# EAGLE design Serial-7-Segment-Shield (EAGLE 6.5.0)
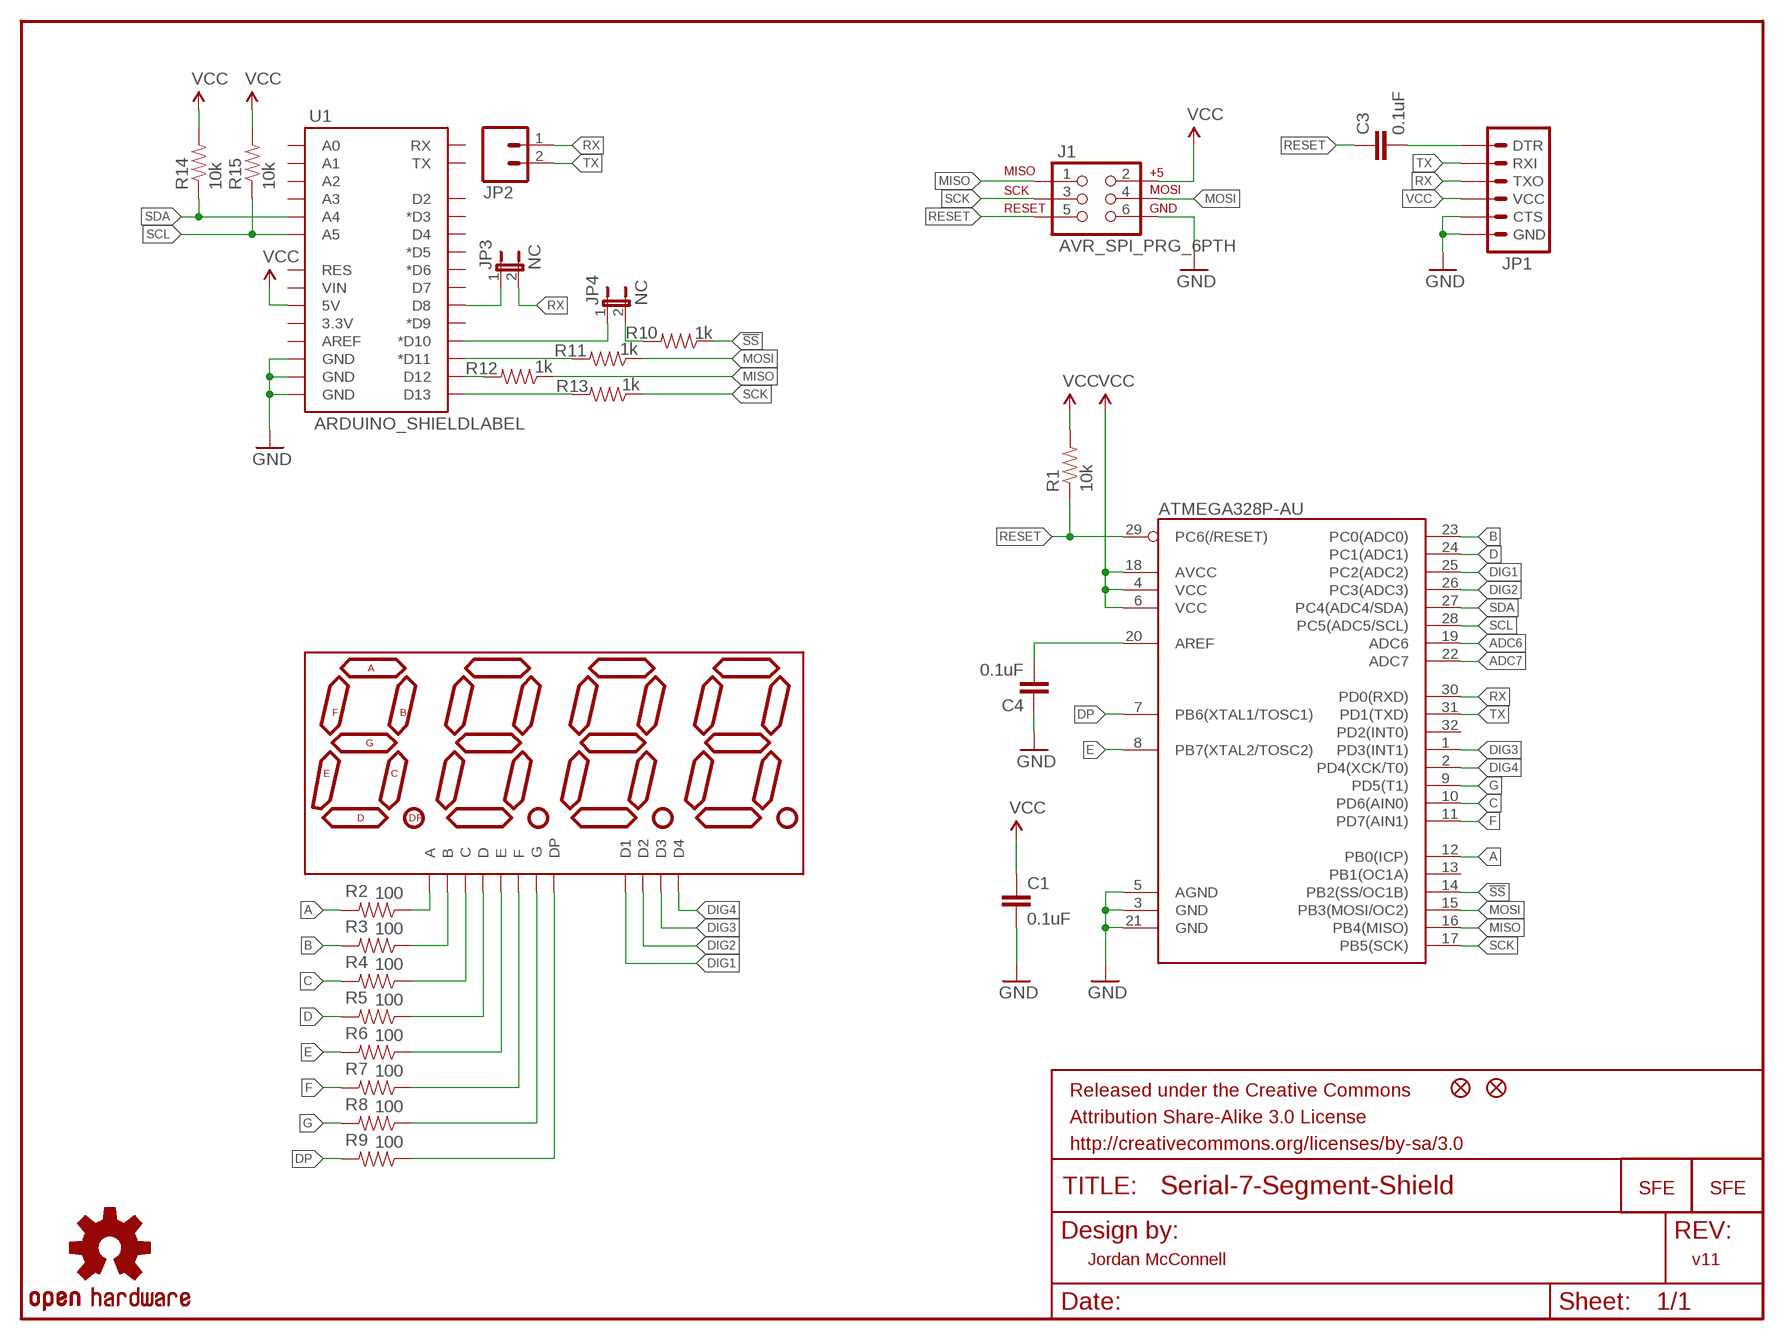
[diagram p0: schematic, sheet 1]

## Parts
ATMEGA328P-AU  ATMEGA328P-AU  ATMEGA168  [TQFP32-08]
C1  0.1uF  CAP0603-CAP  [0603-CAP]
C3  0.1uF  CAP0603-CAP  [0603-CAP]
C4  0.1uF  CAP0603-CAP  [0603-CAP]
FRAME1  FRAME-LETTER  [CREATIVE_COMMONS]
J1  AVR_SPI_PRG_6PTH  [2X3]
JP1  ARDUINO_SERIAL_PROGRAMPTH  [1X06]
JP2  M02PTH  [1X02]
JP3  NC  JUMPER-2SMD-NC  [SJ_2S]
JP4  NC  JUMPER-2SMD-NC  [SJ_2S]
JP9  FIDUCIALUFIDUCIAL  [MICRO-FIDUCIAL]
JP10  FIDUCIALUFIDUCIAL  [MICRO-FIDUCIAL]
LOGO1  LOGO-SFENEW  [SFE-NEW-WEBLOGO]
LOGO2  LOGO-SFENEW  [SFE-NEW-WEBLOGO]
R1  10k  RESISTOR0603-RES  [0603-RES]
R2  100  RESISTOR0603-RES  [0603-RES]
R3  100  RESISTOR0603-RES  [0603-RES]
R4  100  RESISTOR0603-RES  [0603-RES]
R5  100  RESISTOR0603-RES  [0603-RES]
R6  100  RESISTOR0603-RES  [0603-RES]
R7  100  RESISTOR0603-RES  [0603-RES]
R8  100  RESISTOR0603-RES  [0603-RES]
R9  100  RESISTOR0603-RES  [0603-RES]
R10  1k  RESISTOR0603-RES  [0603-RES]
R11  1k  RESISTOR0603-RES  [0603-RES]
R12  1k  RESISTOR0603-RES  [0603-RES]
R13  1k  RESISTOR0603-RES  [0603-RES]
R14  10k  RESISTOR0603-RES  [0603-RES]
R15  10k  RESISTOR0603-RES  [0603-RES]
U1  ARDUINO_SHIELDLABEL  [DUEMILANOVE_SHIELD]
U$1  7-SEGMENT-4DIGIT-COUNTERPTH  [7-SEGMENT-4DIGIT-COUNTER]
U$4  OSHW-LOGOS  [OSHW-LOGO-S]

## Nets
!SS: ATMEGA328P-AU.14(PB2(SS/OC1B)) R10.1
A: ATMEGA328P-AU.12(PB0(ICP)) R2.2
ADC6: ATMEGA328P-AU.19(ADC6)
ADC7: ATMEGA328P-AU.22(ADC7)
B: ATMEGA328P-AU.23(PC0(ADC0)) R3.2
C: ATMEGA328P-AU.10(PD6(AIN0)) R4.2
D: ATMEGA328P-AU.24(PC1(ADC1)) R5.2
DIG1: ATMEGA328P-AU.25(PC2(ADC2)) U$1.12(D1)
DIG2: ATMEGA328P-AU.26(PC3(ADC3)) U$1.9(D2)
DIG3: ATMEGA328P-AU.1(PD3(INT1)) U$1.8(D3)
DIG4: ATMEGA328P-AU.2(PD4(XCK/T0)) U$1.6(D4)
DP: ATMEGA328P-AU.7(PB6(XTAL1/TOSC1)) R9.2
E: ATMEGA328P-AU.8(PB7(XTAL2/TOSC2)) R6.2
F: ATMEGA328P-AU.11(PD7(AIN1)) R7.2
G: ATMEGA328P-AU.9(PD5(T1)) R8.2
GND: ATMEGA328P-AU.3(GND) ATMEGA328P-AU.5(AGND) ATMEGA328P-AU.21(GND) C1.2 C4.1 J1.6 JP1.5(CTS) JP1.6(GND) U1.GND@0(GND) U1.GND@1(GND) U1.GND@2(GND)
MISO: ATMEGA328P-AU.16(PB4(MISO)) J1.1 R12.1
MOSI: ATMEGA328P-AU.15(PB3(MOSI/OC2)) J1.4 R11.1
N$1: ATMEGA328P-AU.20(AREF) C4.2
N$2: R13.2 U1.D13
N$3: R12.2 U1.D12
N$4: R11.2 U1.D11(*D11)
N$5: JP4.2 R10.2
N$6: JP4.1 U1.D10(*D10)
N$7: JP3.1 U1.D8
N$11: R2.1 U$1.11(A)
N$12: R3.1 U$1.7(B)
N$13: C3.2 JP1.1(DTR)
N$14: R4.1 U$1.4(C)
N$15: R5.1 U$1.2(D)
N$16: R6.1 U$1.1(E)
N$17: R7.1 U$1.10(F)
N$18: R8.1 U$1.5(G)
N$19: R9.1 U$1.3(DP)
RESET: ATMEGA328P-AU.29(PC6(/RESET)) C3.1 J1.5 R1.1
RX: ATMEGA328P-AU.30(PD0(RXD)) JP1.3(TXO) JP2.1 JP3.2
SCK: ATMEGA328P-AU.17(PB5(SCK)) J1.3 R13.1
SCL: ATMEGA328P-AU.28(PC5(ADC5/SCL)) R15.1 U1.A5
SDA: ATMEGA328P-AU.27(PC4(ADC4/SDA)) R14.1 U1.A4
TX: ATMEGA328P-AU.31(PD1(TXD)) JP1.2(RXI) JP2.2
VCC: ATMEGA328P-AU.4(VCC) ATMEGA328P-AU.6(VCC) ATMEGA328P-AU.18(AVCC) C1.1 J1.2 JP1.4(VCC) R1.2 R14.2 R15.2 U1.5V
Unconnected: ATMEGA328P-AU.13(PB1(OC1A)) ATMEGA328P-AU.32(PD2(INT0)) U1.3.3V U1.A0 U1.A1 U1.A2 U1.A3 U1.AREF U1.D2 U1.D3(*D3) U1.D4 U1.D5(*D5) U1.D6(*D6) U1.D7 U1.D9(*D9) U1.RES U1.RX U1.TX U1.VIN

## Notes on the sheet
- Jordan McConnell | v11

## Library data of the parts
ATMEGA328P-AU = SparkFun:ATMEGA168
C1 = SparkFun:CAP: Capacitor Standard 0603 ceramic capacitor, and 0.1" leaded capacitor.
C3 C4 = SparkFun-Passives:CAP: Capacitor Standard 0603 ceramic capacitor, and 0.1" leaded capacitor.
FRAME1 = SparkFun-Aesthetics:FRAME-LETTER: Schematic Frame Standard 8.5x11 US Letter frame
J1 = SparkFun-Connectors:AVR_SPI_PRG_6: AVR ISP 6 Pin This is the reduced ISP connector for AVR programming. Common on Arduino. This footprint will take up less PCB space and can be used with a 10-pin to 6-pin adapter such as SKU: BOB-08508
JP1 = SparkFun-Connectors:ARDUINO_SERIAL_PROGRAM: FTDI connector footprints
JP2 = SparkFun-Connectors:M02: Header 2 Standard 2-pin 0.1" header. Use with straight break away headers (SKU : PRT-00116), right angle break away headers (PRT-00553), swiss pins (PRT-00743), machine pins (PRT-00117), and female headers (PRT-00115). Molex polarized connector foot print use with SKU : PRT-08233 with associated crimp pins and housings.
JP3 JP4 = SparkFun-Passives:JUMPER-2: Jumper Basic 0.1" spaced jumper. Use with breakaway headers.
JP9 JP10 = SparkFun:FIDUCIAL: Fiducial Alignment Points Various fiducial points for machine vision alignment.
LOGO1 LOGO2 = SparkFun-Aesthetics:LOGO-SFE: Spark Fun Electronics PCB Logo This is the standard Spark Fun Electronics PCB logo.
R1-R15 = SparkFun:RESISTOR: Resistor Basic schematic elements and footprints for 0603, 1206, and PTH 1/10th watt (small) resistors.
U1 = SparkFun-Boards:ARDUINO_SHIELD: Arduino shield footprint
U$1 = SparkFun-Displays:7-SEGMENT-4DIGIT-COUNTER
U$4 = SparkFun-Aesthetics:OSHW-LOGO: Open Source Hardware Logo This logo indicates the piece of hardware it is found on incorporates a OSHW license and/or adheres to the definition of open source hardware found here: http://freedomdefined.org/OSHW

## Board
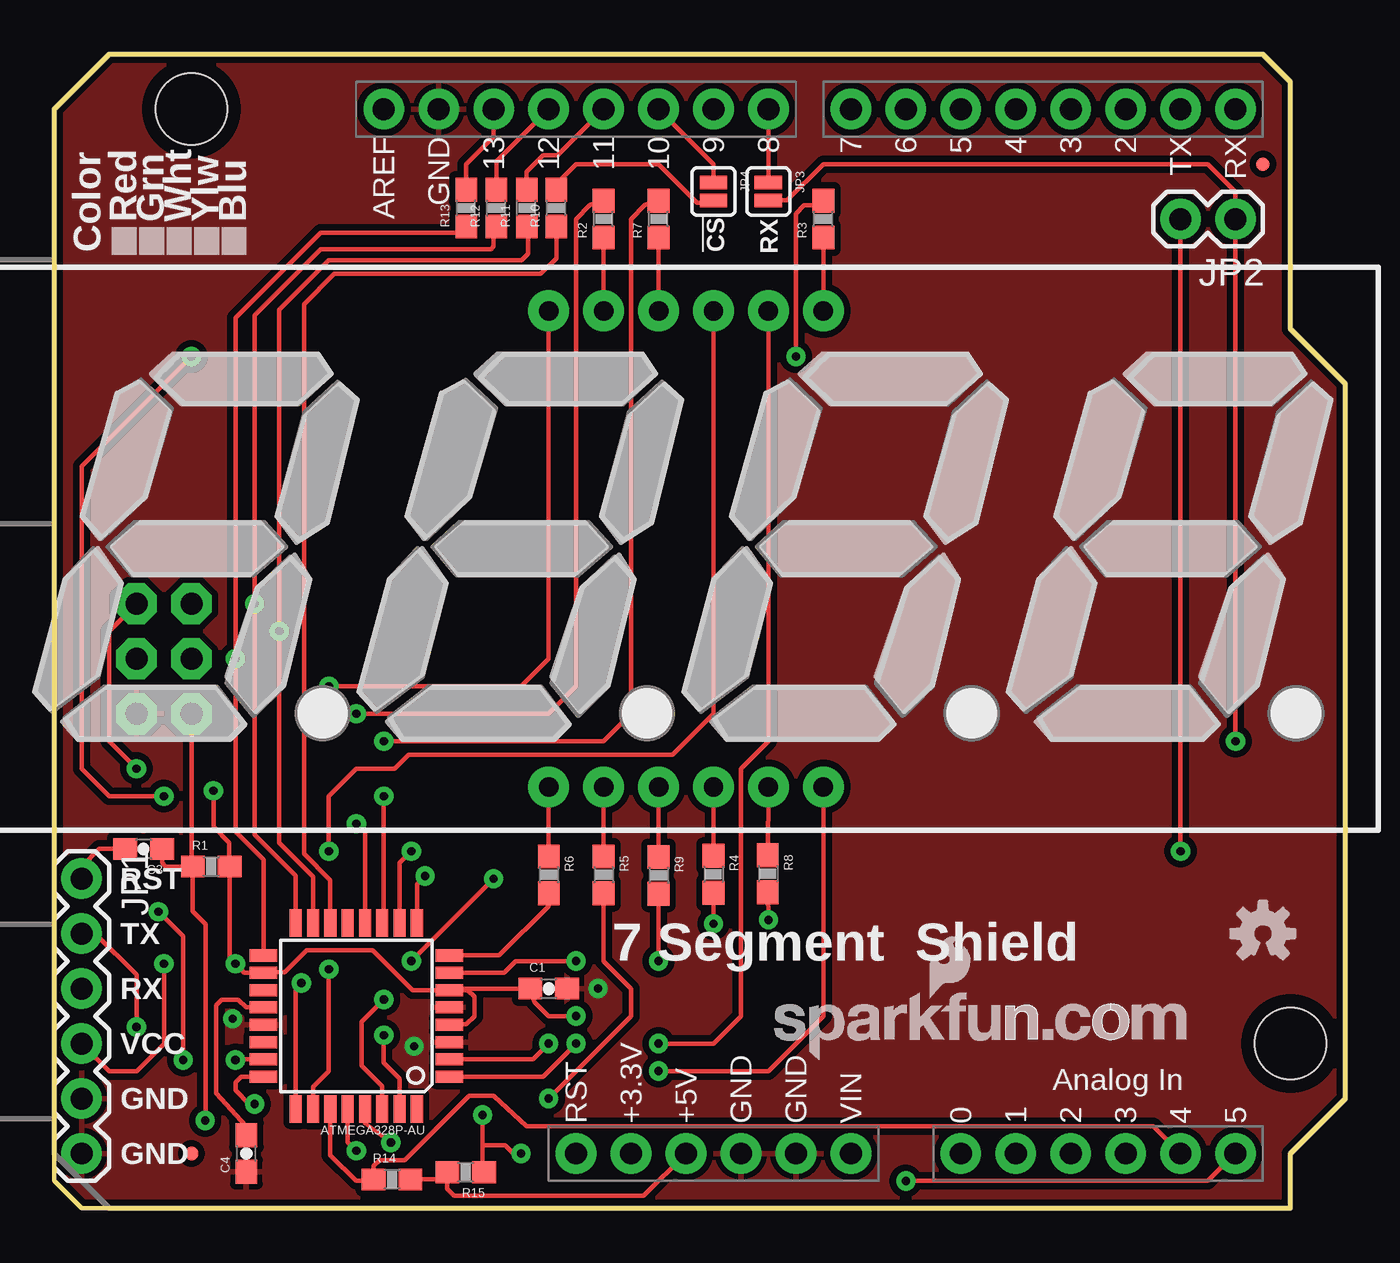
[diagram p1: board, top side]
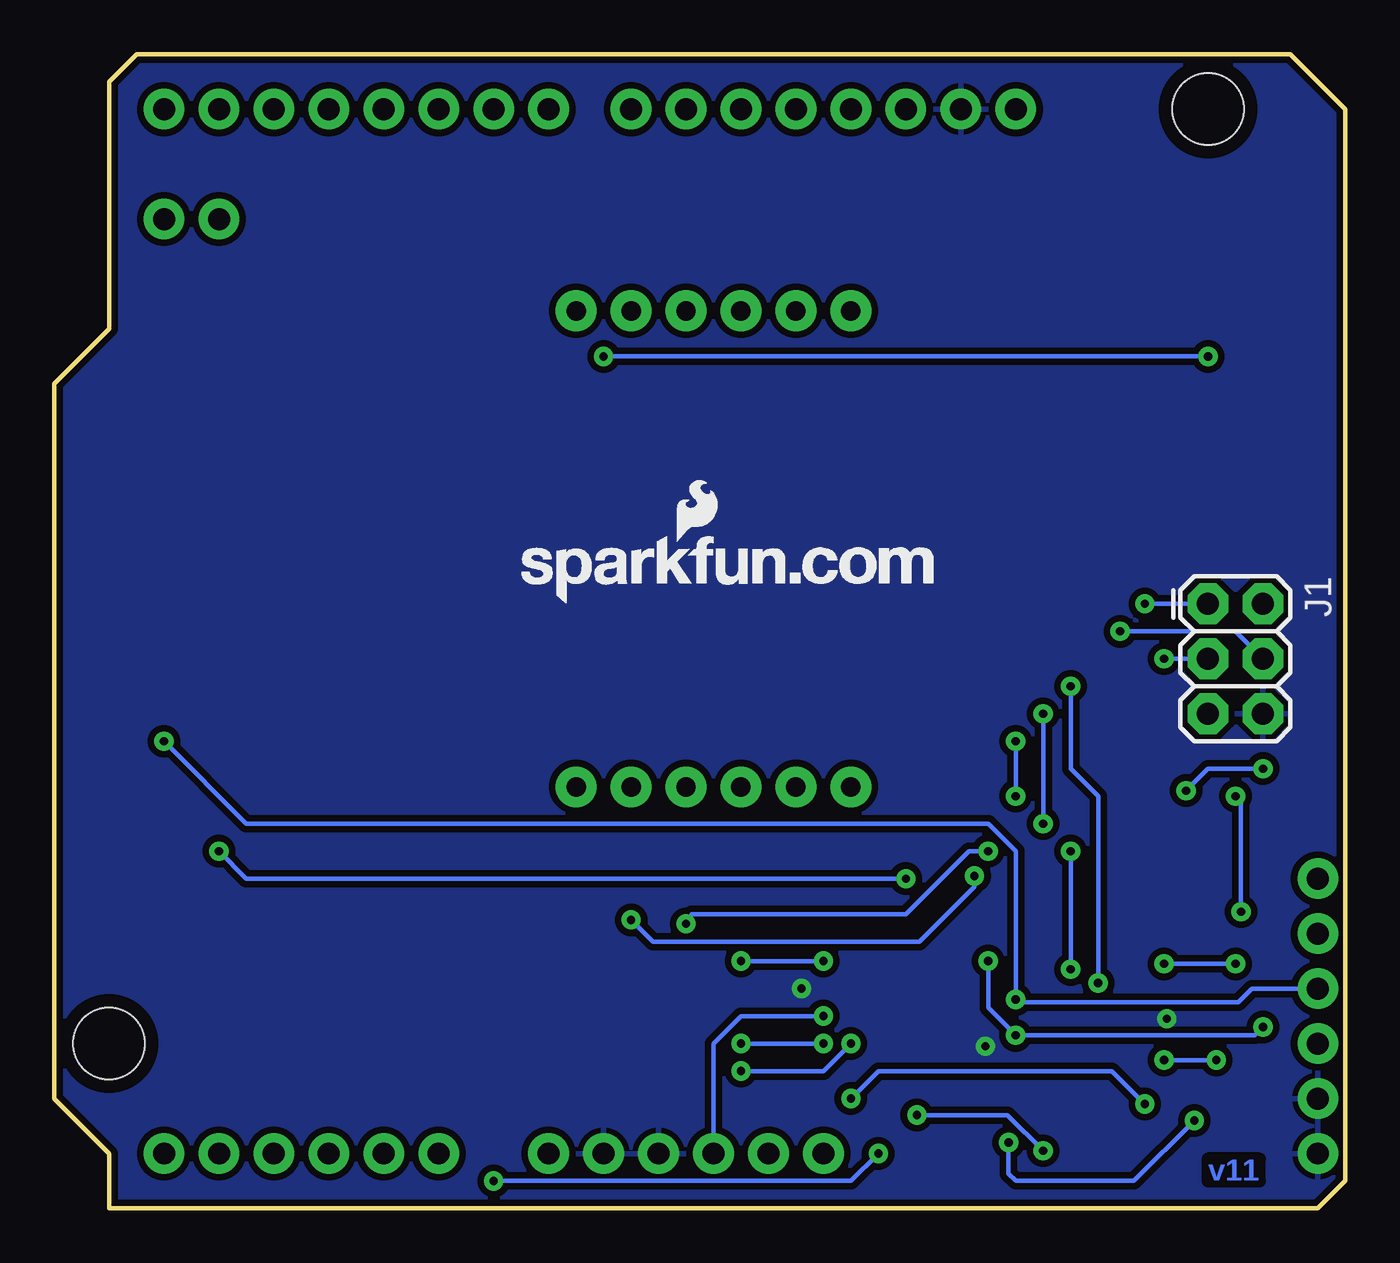
[diagram p2: board, bottom side, seen from below]

Size 59.69 x 53.34 mm. Coordinates in mm from the lower left corner, seen from the top.
Outline: 0,1.27 0,50.8 2.54,53.34 55.88,53.34 57.15,52.07 57.15,40.64 59.69,38.1 59.69,5.08 57.15,2.54 57.15,0 1.27,0 0,1.27
Copper layers (1*16): Top 0.035mm / dielectric 1.5mm / Bottom 0.035mm
Design rules "SparkFun": minimum track width 7mil, minimum drill 15mil, track to track 8mil, track to pad 8mil, pad to pad 8mil, via to via 8mil, smd to smd 8mil, copper to edge 8mil, drill to drill 8mil, minimum pad ring 12mil, minimum via ring 10mil, stop-mask expansion 4mil, vias tented up to drill 20mil, thermal gap 10mil

### Footprints (pad centres in the part's own frame; a part is rotated, then mirrored left to right if it is on the bottom)
TQFP32-08 = smd 1.27 x 0.559: 1 -4.293,2.8; 2 -4.293,2; 3 -4.293,1.2; 4 -4.293,0.4; 5 -4.293,-0.4; 6 -4.293,-1.2; 7 -4.293,-2; 8 -4.293,-2.8; 17 4.293,-2.8; 18 4.293,-2; 19 4.293,-1.2; 20 4.293,-0.4; 21 4.293,0.4; 22 4.293,1.2; 23 4.293,2; 24 4.293,2.8 | smd 0.559 x 1.27: 9 -2.8,-4.293; 10 -2,-4.293; 11 -1.2,-4.293; 12 -0.4,-4.293; 13 0.4,-4.293; 14 1.2,-4.293; 15 2,-4.293; 16 2.8,-4.293; 25 2.8,4.293; 26 2,4.293; 27 1.2,4.293; 28 0.4,4.293; 29 -0.4,4.293; 30 -1.2,4.293; 31 -2,4.293; 32 -2.8,4.293
0603-CAP = smd 1.1 x 1: 1 -0.85,0; 2 0.85,0
2X3 = drill 1.016 pad 1.88 octagon: 1 0,0; 2 0,2.54; 3 2.54,0; 4 2.54,2.54; 5 5.08,0; 6 5.08,2.54
1X06 = drill 1.016 pad 1.88: 1 0,0; 2 2.54,0; 3 5.08,0; 4 7.62,0; 5 10.16,0; 6 12.7,0
1X02 = drill 1.016 pad 1.88: 1 0,0; 2 2.54,0
SJ_2S = smd 0.635 x 1.27: 1 -0.412,0; 2 0.412,0
MICRO-FIDUCIAL = smd 0.635 x 0.635: 1 0,0
0603-RES = smd 1.1 x 1: 1 -0.85,0; 2 0.85,0
DUEMILANOVE_SHIELD = drill 1.016 pad 1.88: 3.3V 50.8,26.67; 5V 50.8,29.21; A0 50.8,41.91; A1 50.8,44.45; A2 50.8,46.99; A3 50.8,49.53; A4 50.8,52.07; A5 50.8,54.61; AREF 2.54,15.24; D2 2.54,49.53; D3 2.54,46.99; D4 2.54,44.45; D5 2.54,41.91; D6 2.54,39.37; D7 2.54,36.83; D8 2.54,33.02; D9 2.54,30.48; D10 2.54,27.94; D11 2.54,25.4; D12 2.54,22.86; D13 2.54,20.32; GND@0 50.8,31.75; GND@1 50.8,34.29; GND@2 2.54,17.78; RES 50.8,24.13; RX 2.54,54.61; TX 2.54,52.07; VIN 50.8,36.83 | hole 3.302: 45.72,57.15; 2.54,6.35
7-SEGMENT-4DIGIT-COUNTER = drill 0.9 pad 1.88: 1 -6.35,-10.998; 2 -3.81,-10.998; 3 -1.27,-10.998; 4 1.27,-10.998; 5 3.81,-10.998; 6 6.35,-10.998; 7 6.35,10.998; 8 3.81,10.998; 9 1.27,10.998; 10 -1.27,10.998; 11 -3.81,10.998; 12 -6.35,10.998

### Placement (x,y rotation side)
ATMEGA328P-AU  13.97,8.89 180 top
C1  22.86,10.16 0 top
C3  4.14,16.61 180 top
C4  8.89,2.54 90 top
FRAME1  8.89,-16.51 0 top  (outside the outline)
J1  6.35,27.94 270 bottom
JP1  1.27,15.24 270 top
JP2  54.61,45.72 180 top
JP3  33.02,46.99 270 top
JP4  30.48,46.99 270 top
JP9  55.88,48.26 0 top
JP10  6.35,2.54 0 top
LOGO1  33.27,6.86 0 top
LOGO2  38.1,27.94 0 bottom
R1  7.26,15.8 0 top
R2  25.4,45.72 90 top
R3  35.56,45.72 90 top
R4  30.48,15.44 270 top
R5  25.4,15.42 270 top
R6  22.86,15.42 270 top
R7  27.94,45.72 90 top
R8  32.99,15.47 270 top
R9  27.94,15.39 270 top
R10  23.22,46.23 90 top
R11  21.84,46.23 90 top
R12  20.45,46.23 90 top
R13  19.05,46.23 90 top
R14  15.62,1.35 0 top
R15  19.02,1.68 180 top
U1  0,53.34 270 top
U$1  29.21,30.48 0 top
U$4  55.88,12.7 0 top

### Tracks (layer width: path | path; a pad name or v marks a point on that pad's centre or on a via)
!SS
  Top 0.203: ATMEGA328P-AU.14 12.77,15.17 11.56,16.38 11.56,41.78 12.95,43.18 22.48,43.18 23.22,43.92 R10.1 23.09,45.35
A  (via drill 0.38)
  Top 0.203: R2.2 24.78,46.37 24.13,45.72 24.13,24.13 22.86,22.86 v13.97,22.86 | v13.97,17.78 14.37,17.38 ATMEGA328P-AU.12
  Bottom 0.203: v13.97,22.86 v13.97,17.78
B  (via drill 0.38)
  Top 0.203: ATMEGA328P-AU.23 8.41,6.89 v8.38,6.86 | v5.97,6.86 5.97,12.57 v4.83,13.72 | v6.35,39.37 5.08,38.1 1.27,34.29 1.27,20.32 2.54,19.05 v5.08,19.05 | v34.29,39.37 34.29,45.97 34.67,46.35 35.55,46.35 R3.2
  Bottom 0.203: v8.38,6.86 v5.97,6.86 | v4.83,13.72 4.83,18.8 v5.08,19.05 | v6.35,39.37 v34.29,39.37
C  (via drill 0.38)
  Top 0.203: R4.2 v30.48,13.16 | v16.51,16.51 15.97,15.97 ATMEGA328P-AU.10
  Bottom 0.203: v30.48,13.16 30.23,13.59 20.32,13.59 17.4,16.51 v16.51,16.51
D  (via drill 0.38)
  Top 0.203: v22.86,5.08 26.67,8.89 26.67,10.16 25.4,11.43 R5.2 | v9.27,4.83 9.02,4.83 8.38,5.46 8.38,5.84 8.64,6.1 ATMEGA328P-AU.24
  Bottom 0.203: v22.86,5.08 21.59,6.35 10.79,6.35 v9.27,4.83
DIG1  (via drill 0.38)
  Top 0.203: U$1.12 22.86,25.4 21.59,24.13 v12.7,24.13 | ATMEGA328P-AU.25 11.17,10.15 v11.43,10.41
  Bottom 0.203: v11.43,10.41 11.43,19.05 12.7,20.32 v12.7,24.13
DIG2  (via drill 0.38)
  Top 0.203: U$1.9 30.48,22.86 28.57,20.95 16.38,20.95 15.75,20.32 13.97,20.32 12.7,19.05 v12.7,16.51 | v12.7,11.05 12.7,6.35 11.97,5.62 ATMEGA328P-AU.26
  Bottom 0.203: v12.7,16.51 v12.7,11.05
DIG3  (via drill 0.38)
  Top 0.203: U$1.8 33.02,21.59 31.75,20.32 31.75,8.89 30.48,7.62 v27.94,7.62 | v24.13,7.62 22.6,6.09 ATMEGA328P-AU.1
  Bottom 0.203: v27.94,7.62 v24.13,7.62
DIG4  (via drill 0.38)
  Top 0.203: U$1.6 35.56,8.89 33.02,6.35 v27.94,6.35 | v22.86,7.62 22.13,6.89 ATMEGA328P-AU.2
  Bottom 0.203: v22.86,7.62 24.13,6.35 v27.94,6.35
DP  (via drill 0.38)
  Top 0.203: R9.2 v27.94,11.43 | v24.13,11.43 21.34,11.43 20.8,10.89 ATMEGA328P-AU.7
  Bottom 0.203: v27.94,11.43 v24.13,11.43
E
  Top 0.203: R6.2 22.86,13.97 20.58,11.69 ATMEGA328P-AU.8
F  (via drill 0.38)
  Top 0.203: R7.2 27.32,46.37 26.67,45.72 26.67,22.86 25.4,21.59 v15.24,21.59 | v15.24,19.05 15.24,13.25 ATMEGA328P-AU.11
  Bottom 0.203: v15.24,21.59 v15.24,19.05
G  (via drill 0.38)
  Top 0.203: v17.14,15.37 16.77,14.99 ATMEGA328P-AU.9 | R8.2 v33.02,13.34
  Bottom 0.203: v17.14,15.37 17.14,14.86 19.68,12.32 32,12.32 v33.02,13.34
GND  (via drill 0.38)
  other vias: 25.15,10.16 16.64,7.49 8.26,8.76
  pour Top (isolate 0.305): 0,1.27 0,50.8 2.54,53.34 55.88,53.34 57.15,52.07 57.15,40.64 59.69,38.1 59.69,5.08 57.15,2.54 57.15,0 1.27,0
  pour Bottom (isolate 0.305): 0,1.27 0,50.8 2.54,53.34 55.88,53.34 57.15,52.07 57.15,40.64 59.69,38.1 59.69,5.08 57.15,2.54 57.15,0 1.27,0
MISO  (via drill 0.38)
  Top 0.203: ATMEGA328P-AU.16 11.17,15.37 9.27,17.27 v9.27,27.94 9.27,41.27 12.32,44.32 20.19,44.32 20.32,44.45 20.32,45.25 R12.1
  Bottom 0.203: J1.1 v9.27,27.94
MOSI  (via drill 0.38)
  Top 0.203: ATMEGA328P-AU.15 11.97,15.34 10.41,16.89 v10.41,26.67 10.41,41.53 12.7,43.81 21.61,43.81 21.92,44.12 21.92,45.3 R11.1
  Bottom 0.203: J1.4 5.08,26.67 v10.41,26.67
N$1
  Top 0.203: C4.2 8.89,3.81 7.49,5.33 7.49,9.4 7.75,9.65 8.51,9.65 8.87,9.29 ATMEGA328P-AU.20
N$2
  Top 0.203: R13.2 19.05,48.26 20.32,49.53 U1.D13
N$3
  Top 0.203: R12.2 20.45,48.39 U1.D12
N$4
  Top 0.203: 21.59,46.99 R11.2 21.84,47.9 22.61,48.67 23.27,48.67 U1.D11
N$5
  Top 0.203: R10.2 22.86,46.99 24.13,48.26 27.94,48.26 29.72,46.48 30.38,46.48 JP4.2
N$6
  Top 0.203: JP4.1 30.48,48.26 U1.D10
N$7
  Top 0.203: JP3.1 U1.D8
N$11
  Top 0.203: U$1.11 R2.1
N$12
  Top 0.203: U$1.7 R3.1
N$13
  Top 0.203: JP1.1 1.27,15.8 2.08,16.61 C3.2
N$14
  Top 0.203: U$1.4 R4.1
N$15
  Top 0.203: R5.1 U$1.2
N$16
  Top 0.203: R6.1 U$1.1
N$17
  Top 0.203: U$1.10 R7.1
N$18
  Top 0.203: R8.1 U$1.5
N$19
  Top 0.203: R9.1 U$1.3
RESET  (via drill 0.38)
  Top 0.203: ATMEGA328P-AU.29 14.37,3.94 v15.57,3.05 | R1.1 6.35,15.86 J1.5 | v6.99,4.06 7.01,4.09 7.01,13.13 6.41,13.73 R1.1 | C3.1 4.99,15.96 5.16,15.8 R1.1
  Bottom 0.203: v6.99,4.06 9.78,1.27 15.24,1.27 15.57,1.6 v15.57,3.05
RX  (via drill 0.38)
  Top 0.203: ATMEGA328P-AU.30 15.17,5.66 14.22,6.6 14.22,8.64 v15.24,9.65 | v54.61,21.59 JP2.1 54.61,46.99 53.34,48.26 35.56,48.26 33.88,46.58 JP3.2
  Bottom 0.203: v54.61,21.59 50.8,17.78 16.51,17.78 15.24,16.51 v15.24,9.65 15.11,9.53 4.95,9.53 4.32,10.16 JP1.3
SCK  (via drill 0.38)
  Top 0.203: ATMEGA328P-AU.17 9.68,16.1 8.38,17.4 v8.38,25.4 8.38,41.15 12.32,45.09 18.76,45.09 R13.1
  Bottom 0.203: J1.3 v8.38,25.4
SCL  (via drill 0.38)
  Top 0.203: U1.A5 53.34,1.27 v39.37,1.27 | v13.97,2.67 13.57,3.07 ATMEGA328P-AU.28 | v21.59,2.54 21.23,2.54 20.85,2.92 19.81,2.92 | v19.81,4.32 19.81,2.92 | R15.1 19.81,1.74 19.81,2.54 19.81,2.92
  Bottom 0.203: v19.81,4.32 15.62,4.32 v13.97,2.67 | v21.59,2.54 22.86,1.27 v39.37,1.27
SDA
  Top 0.203: U1.A4 50.8,3.81 21.84,3.81 20.32,5.21 19.18,5.21 16.2,2.23 15.04,2.23 14.77,1.97 R14.1 14.7,1.27 13.97,1.27 12.77,2.47 ATMEGA328P-AU.27
TX  (via drill 0.38)
  Top 0.203: v16.51,11.43 v20.32,15.24 | ATMEGA328P-AU.31 15.97,6 15.24,6.73 v15.24,8 | JP1.2 1.91,12.7 3.81,10.79 v3.81,8.38 | v52.07,16.51 JP2.2
  Bottom 0.203: v20.32,15.24 50.8,15.24 v52.07,16.51 | v16.51,11.43 16.51,9.27 v15.24,8 4.19,8 v3.81,8.38
VCC  (via drill 0.38)
  Top 0.203: ATMEGA328P-AU.6 18.33,10.16 C1.1 22.21,9.54 22.86,8.89 v24.13,8.89 | ATMEGA328P-AU.6 16.58,10.09 14.73,11.94 11.68,11.94 10.67,10.92 9.71,10.92 ATMEGA328P-AU.18 8.79,10.89 v8.38,11.3 8.11,11.57 R1.2 8.1,16.89 7.37,17.63 v7.37,19.3 | ATMEGA328P-AU.6 19.12,10.09 19.43,9.78 19.43,8.89 19.05,8.51 18.28,8.51 ATMEGA328P-AU.4 | v5.08,11.3 5.08,7.62 3.81,6.35 2.54,6.35 JP1.4 | J1.2 2.54,26.67 2.54,21.59 v3.81,20.32 | U1.5V 27.25,0.58 18.49,0.58 18.18,0.9 R15.2 17.84,1.35 R14.2
  Bottom 0.203: v24.13,8.89 27.94,8.89 29.21,7.62 U1.5V | v8.38,11.3 v5.08,11.3 | v3.81,20.32 6.35,20.32 v7.37,19.3

### Text on the board
Bottom: v11
tPlace: Red | Grn | Wht | Ylw | Blu | RX | Color | !CS | RST | TX | 7 Segment Shield | RX | VCC | GND | GND
tValues: Jordan McConnell